# EAGLE design board (EAGLE 9.5.1)
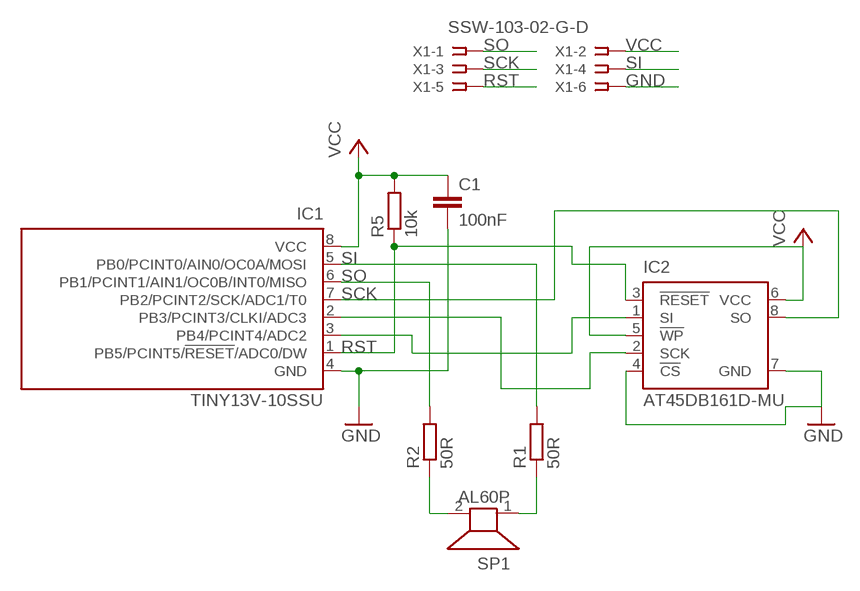
[diagram p0: schematic, sheet 1]

## Parts
C1  100nF  C-EUC1206K  [C1206K]
IC1  TINY13V-10SSU  [8S1]
IC2  AT45DB161D-MU  [VDFN-8]
R1  50R  R-EU_0204/5  [0204/5]
R2  50R  R-EU_0204/5  [0204/5]
R5  10k  R-EU_0204/5  [0204/5]
SP1  AL60P  [AL60P]
X1  SSW-103-02-G-D  [SSW-103-02-G-D]

## Nets
GND: C1.2 IC1.4(GND) IC2.4(!CS) IC2.7(GND) X1.6
N$1: IC1.3(PB4/PCINT4/ADC2) IC2.1(SI)
N$2: R1.1 SP1.1
N$3: IC1.2(PB3/PCINT3/CLKI/ADC3) IC2.2(SCK)
N$4: R2.1 SP1.2
RST: IC1.1(PB5/PCINT5/!RESET!/ADC0/DW) IC2.3(!RESET) R5.1 X1.5
SCK: IC1.7(PB2/PCINT2/SCK/ADC1/T0) IC2.8(SO) X1.3
SI: IC1.5(PB0/PCINT0/AIN0/OC0A/MOSI) R1.2 X1.4
SO: IC1.6(PB1/PCINT1/AIN1/OC0B/INT0/MISO) R2.2 X1.1
VCC: C1.1 IC1.8(VCC) IC2.5(!WP) IC2.6(VCC) R5.2 X1.2

## Library data of the parts
C1 = resistor:C-EU: CAPACITOR, European symbol
IC1 = atmel:TINY13: 8-bit AVR Microcontroller with 1K Bytes In-System Programmable Flash Source: http://www.atmel.com/dyn/resources/prod_documents/2535S.pdf; MPN: ATTINY13V-10SSU; OC_FARNELL: 1455135; OC_NEWARK: 58M3773
IC2 = atmel:AT45DB161D: 16-megabit 2.5V or 2.7V DataFlash Source: http://www.atmel.com/dyn/resources/prod_documents/doc3500.pdf; MF: ATMEL; MPN: AT45DB161D-SU; OC_FARNELL: 1455040
R1 R2 R5 = resistor:R-EU_: RESISTOR, European symbol
SP1 = buzzer:AL60P: SPEAKER Source: Buerklin; OC_FARNELL: unknown; OC_NEWARK: unknown
X1 = con-samtec:SSW-103-02-G: THROUGH-HOLE .025" SQ POST SOCKET Source: Samtec SSW.pdf; MF: Samtec Inc.; MPN: SSW-103-02-G-D; OC_FARNELL: unknown; OC_NEWARK: 11P9365

## Board
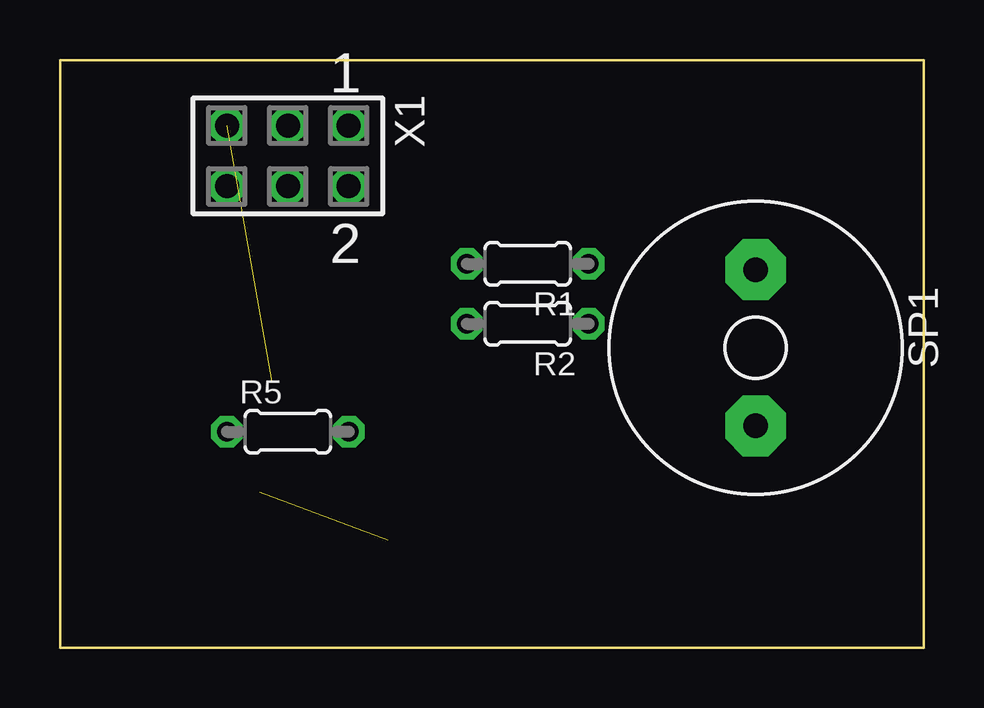
[diagram p1: board, top side]
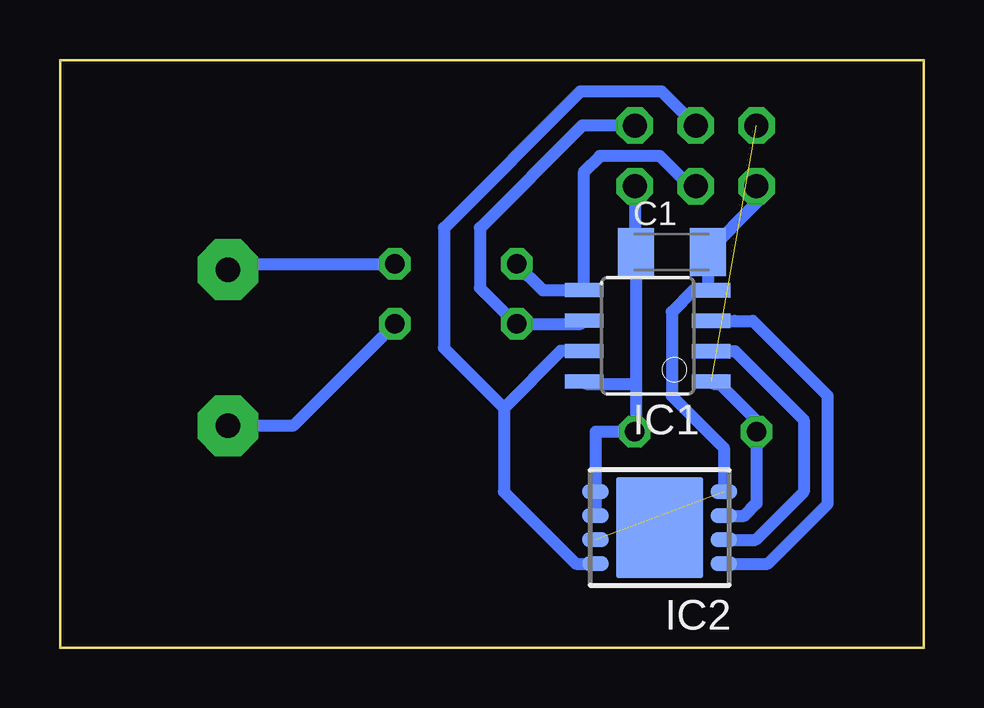
[diagram p2: board, bottom side, seen from below]

Size 36 x 24.5 mm. Coordinates in mm from the lower left corner, seen from the top.
Outline: 0,24.5 36,24.5 36,0 0,0 0,24.5
Copper layers (1*16): Top 0.035mm / dielectric 1.5mm / Bottom 0.035mm
Design rules "default": minimum track width 6mil, minimum drill 0.35mm, track to track 6mil, track to pad 6mil, pad to pad 6mil, via to via 6mil, smd to smd 6mil, copper to edge 40mil, drill to drill 6mil, minimum pad ring 10mil, minimum via ring 8mil, stop-mask expansion 4mil, vias tented up to drill 0mil, thermal gap 10mil

### Footprints (pad centres in the part's own frame; a part is rotated, then mirrored left to right if it is on the bottom)
C1206K = smd 1.5 x 2: 1 -1.5,0; 2 1.5,0
8S1 = smd 0.6 x 1.6: 1 -1.905,-2.654; 2 -0.645,-2.654; 3 0.625,-2.654; 4 1.895,-2.654; 5 1.905,2.654; 6 0.635,2.654; 7 -0.635,2.654; 8 -1.905,2.654
VDFN-8 = smd 1.1 x 0.6: 1 -2.675,1.5; 2 -2.675,0.5; 3 -2.675,-0.5; 4 -2.675,-1.5; 5 2.675,-1.5; 6 2.675,-0.5; 7 2.675,0.5; 8 2.675,1.5 | smd 3.6 x 4.2: 9 0,0
0204/5 = drill 0.813 octagon: 1 -2.54,0; 2 2.54,0
AL60P = drill 1.016 pad 2.54 octagon: 1 -3.251,0; 2 3.251,0
SSW-103-02-G-D = drill 1 pad 1.5 octagon: 1 -2.54,-1.27; 2 -2.54,1.27; 3 0,-1.27; 4 0,1.27; 5 2.54,-1.27; 6 2.54,1.27

### Placement (x,y rotation side)
C1  10.5,16.5 0 bottom
IC1  11.5,13 90 bottom
IC2  11,5 180 bottom
R1  19.5,16 180 top
R2  19.5,13.5 180 top
R5  9.5,9 0 top
SP1  29,12.5 270 top
X1  9.5,20.5 180 top

### Tracks (layer width: path | path; a pad name or v marks a point on that pad's centre or on a via)
GND  (1 unrouted)
  Bottom 0.5: IC2.4 8.32,8.32 10.5,10.5 10.5,14 9.61,14.89 IC1.4 9,15.05 C1.2 6.96,18.54 X1.6
N$1
  Bottom 0.5: 7.88,13.62 IC1.3 7.12,13.62 4,10.5 4,6 6.5,3.5 IC2.1
N$2
  Bottom 0.5: SP1.1 28.75,16 R1.1
N$3
  Bottom 0.5: IC1.2 7.86,12.36 5,9.5 5,6.5 7,4.5 IC2.2
N$4
  Bottom 0.5: R2.1 26.29,9.25 SP1.2
RST  (1 unrouted)
  Bottom 0.5: IC2.3 7.46,5.5 6.96,6 R5.1 6.96,9.46 8.5,11 8.75,11 IC1.1
SCK
  Bottom 0.5: IC1.7 15.14,12.36 17.5,10 | 17.5,10 17.5,6.5 14.5,3.5 IC2.8 | X1.3 10.91,23.18 14.32,23.18 20,17.5 20,12.5 17.5,10
SI
  Bottom 0.5: X1.4 9.73,19.23 11,20.5 13.5,20.5 14.15,19.85 IC1.5 15.86,14.91 R1.2
SO
  Bottom 0.5: X1.1 14.23,21.77 18.5,17.5 18.5,15 17,13.5 R2.2 14.29,13.5 IC1.6
VCC
  Bottom 0.5: IC1.8 13.65,11.09 | IC2.6 IC2.5 13.68,9 R5.2 12,9.04 12,11 | X1.2 12.04,16.54 C1.1 12,11 | 14.14,11.09 IC1.8 | IC1.8 14.06,11 12,11